# EAGLE design mubi-bot-3 (EAGLE 7.2.0)
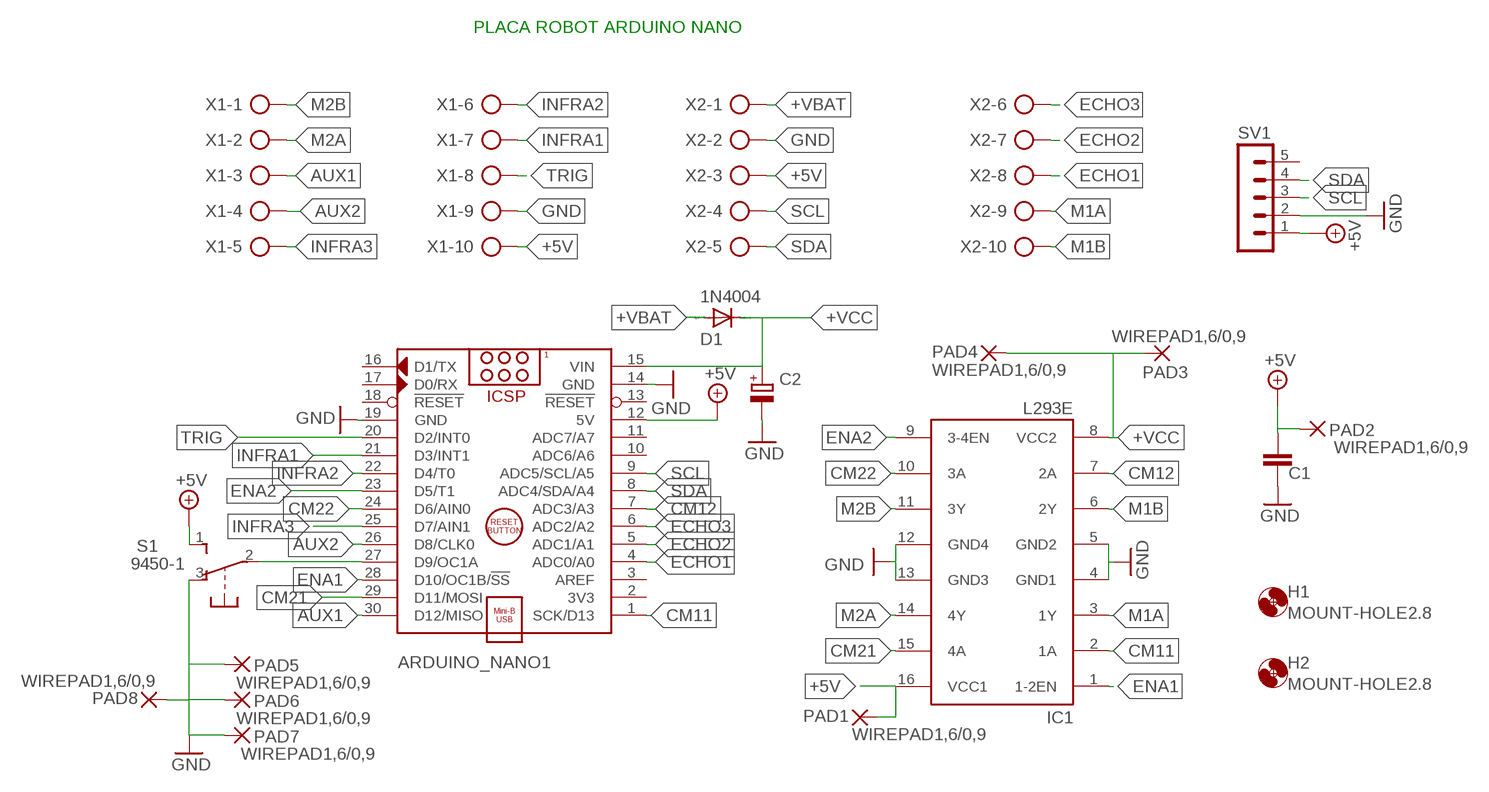
[diagram p0: schematic, sheet 1]

## Parts
ARDUINO_NANO1  ARDUINO_NANO  [ARDUINO_NANO]
C1  C-EU050-025X075  [C050-025X075]
C2  CPOL-EUE2.5-5  [E2,5-5]
D1  1N4004  [DO41-10]
H1  MOUNT-HOLE2.8  [2,8]
H2  MOUNT-HOLE2.8  [2,8]
IC1  L293E  [DIL16]
PAD1  WIREPAD1,6/0,9  [1,6/0,9]
PAD2  WIREPAD1,6/0,9  [1,6/0,9]
PAD3  WIREPAD1,6/0,9  [1,6/0,9]
PAD4  WIREPAD1,6/0,9  [1,6/0,9]
PAD5  WIREPAD1,6/0,9  [1,6/0,9]
PAD6  WIREPAD1,6/0,9  [1,6/0,9]
PAD7  WIREPAD1,6/0,9  [1,6/0,9]
PAD8  WIREPAD1,6/0,9  [1,6/0,9]
S1  9450-1  [9450-1]
SV1  MA05-1  [MA05-1]
X1  AK500/10-H  [AK500/10-H]
X2  AK500/10-H  [AK500/10-H]

## Nets
+5V: ARDUINO_NANO1.12(5V) C1.1 IC1.16(VCC1) PAD1.1(P) PAD2.1(P) S1.1(S) SV1.1 X1.10 X2.3
+VBAT: D1.A X2.1
+VCC: ARDUINO_NANO1.15(VIN) C2.+ D1.C IC1.8(VCC2) PAD3.1(P) PAD4.1(P)
AUX1: ARDUINO_NANO1.30(D12/MISO) X1.3
AUX2: ARDUINO_NANO1.26(D8/CLK0) X1.4
CM11: ARDUINO_NANO1.1(SCK/D13) IC1.2(1A)
CM12: ARDUINO_NANO1.7(ADC3/A3) IC1.7(2A)
CM21: ARDUINO_NANO1.29(D11/MOSI) IC1.15(4A)
CM22: ARDUINO_NANO1.24(D6/AIN0) IC1.10(3A)
ECHO1: ARDUINO_NANO1.4(ADC0/A0) X2.8
ECHO2: ARDUINO_NANO1.5(ADC1/A1) X2.7
ECHO3: ARDUINO_NANO1.6(ADC2/A2) X2.6
ENA1: ARDUINO_NANO1.28(D10/OC1B/!SS) IC1.1(1-2EN)
ENA2: ARDUINO_NANO1.23(D5/T1) IC1.9(3-4EN)
GND: ARDUINO_NANO1.14(GND) ARDUINO_NANO1.19(GND) C1.2 C2.- IC1.12(GND4) IC1.13(GND3) PAD5.1(P) PAD6.1(P) PAD7.1(P) PAD8.1(P) S1.3(O) SV1.2 X1.9 X2.2
INFRA1: ARDUINO_NANO1.21(D3/INT1) X1.7
INFRA2: ARDUINO_NANO1.22(D4/T0) X1.6
INFRA3: ARDUINO_NANO1.25(D7/AIN1) X1.5
M1A: IC1.3(1Y) X2.9
M1B: IC1.6(2Y) X2.10
M2A: IC1.14(4Y) X1.2
M2B: IC1.11(3Y) X1.1
N$1: IC1.4(GND1) IC1.5(GND2) ; supply symbol labelled GND
N$2: ARDUINO_NANO1.27(D9/OC1A) S1.2(P)
SCL: ARDUINO_NANO1.9(ADC5/SCL/A5) SV1.3 X2.4
SDA: ARDUINO_NANO1.8(ADC4/SDA/A4) SV1.4 X2.5
TRIG: ARDUINO_NANO1.20(D2/INT0) X1.8
Unconnected: ARDUINO_NANO1.2(3V3) ARDUINO_NANO1.3(AREF) ARDUINO_NANO1.10(ADC6/A6) ARDUINO_NANO1.11(ADC7/A7) ARDUINO_NANO1.13(!RESET) ARDUINO_NANO1.16(D1/TX) ARDUINO_NANO1.17(D0/RX) ARDUINO_NANO1.18(!RESET) SV1.5

## Notes on the sheet
- PLACA ROBOT ARDUINO NANO

## Library data of the parts
ARDUINO_NANO1 = ArduinoNanoV30:ARDUINO_NANO: Arduino Nano V3.0 Module Overview: The Arduino Nano is a small, complete, and breadboard-friendly board based on the ATmega328 (Arduino Nano 3.x) or ATmega168 (Arduino Nano 2.x). It has more or less the same functionality of the Arduino Duemilanove, but in a different package. It lacks only a DC power jack, and works with a Mini-B USB cable instead of a standard one. The Nano was designed and is being produced by Gravitech <http://www.gravitech.us/arna30wiatp.html>. General specifications: Item Value Microcontroller Atmel ATmega168 or ATmega328 Operating Voltage (logic level) 5 V Input Voltage (recommended) 7-12 V Input Voltage (limits) 6-20 V Digital I/O Pins 14 (of which 6 provide PWM output) Analog Input Pins 8 DC Current per I/O Pin 40 mA Flash Memory 16 KB (ATmega168) or 32 KB (ATmega328) of which 2 KB used by bootloader SRAM 1 KB (ATmega168) or 2 KB (ATmega328) EEPROM 512 bytes (ATmega168) or 1 KB (ATmega328) Clock Speed 16 MHz Dimensions (Inches) 0.73" x 1.70" Dimensions (mm) 18mm x 45mm Overall height About 9 mm (not including pins) Weigth 5 g Power: The Arduino Nano can be powered via the Mini-B USB connection, 6-20V unregulated external power supply (pin 30), or 5V regulated external power supply (pin 27). The power source is automatically selected to the highest voltage source. Memory: The ATmega168 has 16 KB of flash memory for storing code (of which 2 KB is used for the bootloader); the ATmega328 has 32 KB, (also with 2 KB used for the bootloader). The ATmega168 has 1 KB of SRAM and 512 bytes of EEPROM (which can be read and written with the EEPROM library); the ATmega328 has 2 KB of SRAM and 1 KB of EEPROM. Input and Output: Each of the 14 digital pins on the Nano can be used as an input or output, using pinMode(), digitalWrite(), and digitalRead() functions. They operate at 5 volts. Each pin can provide or receive a maximum of 40 mA and has an internal pull-up resistor (disconnected by default) of 20-50 kOhms. In addition, some pins have specialized functions. Visit Arduino - ArduinoBoardNano <https://www.arduino.cc/en/Main/ArduinoBoardNano>
C1 = resistor:C-EU: CAPACITOR, European symbol
C2 = resistor:CPOL-EU: POLARIZED CAPACITOR, European symbol
D1 = diode:1N4004: DIODE general purpose rectifier, 1 A
H1 H2 = holes:MOUNT-HOLE: MOUNTING HOLE with drill center marker
IC1 = texas:L293E: TI DEVICE; MF: Arrow Electronics; MPN: L293E; OC_FARNELL: 1467711; OC_NEWARK: 89K0732
PAD1-PAD8 = wirepad:WIREPAD: Wire PAD connect wire on PCB
S1 = switch-misc:9450-1: MARQUARDT SWITCH
SV1 = con-lstb:MA05-1: PIN HEADER; OC_FARNELL: unknown; OC_NEWARK: unknown
X1 X2 = con-ptr500:AK500/10-H: CONNECTOR Aug. 2004 / PTR Meßtechnik: Die Bezeichnung der Serie AK505 wurde geändert. Es handelt sich hierbei um AK500 in horizontaler Ausführung.; OC_FARNELL: unknown; OC_NEWARK: unknown

## Net classes
0 default: clearance 0.205 mm

## Board
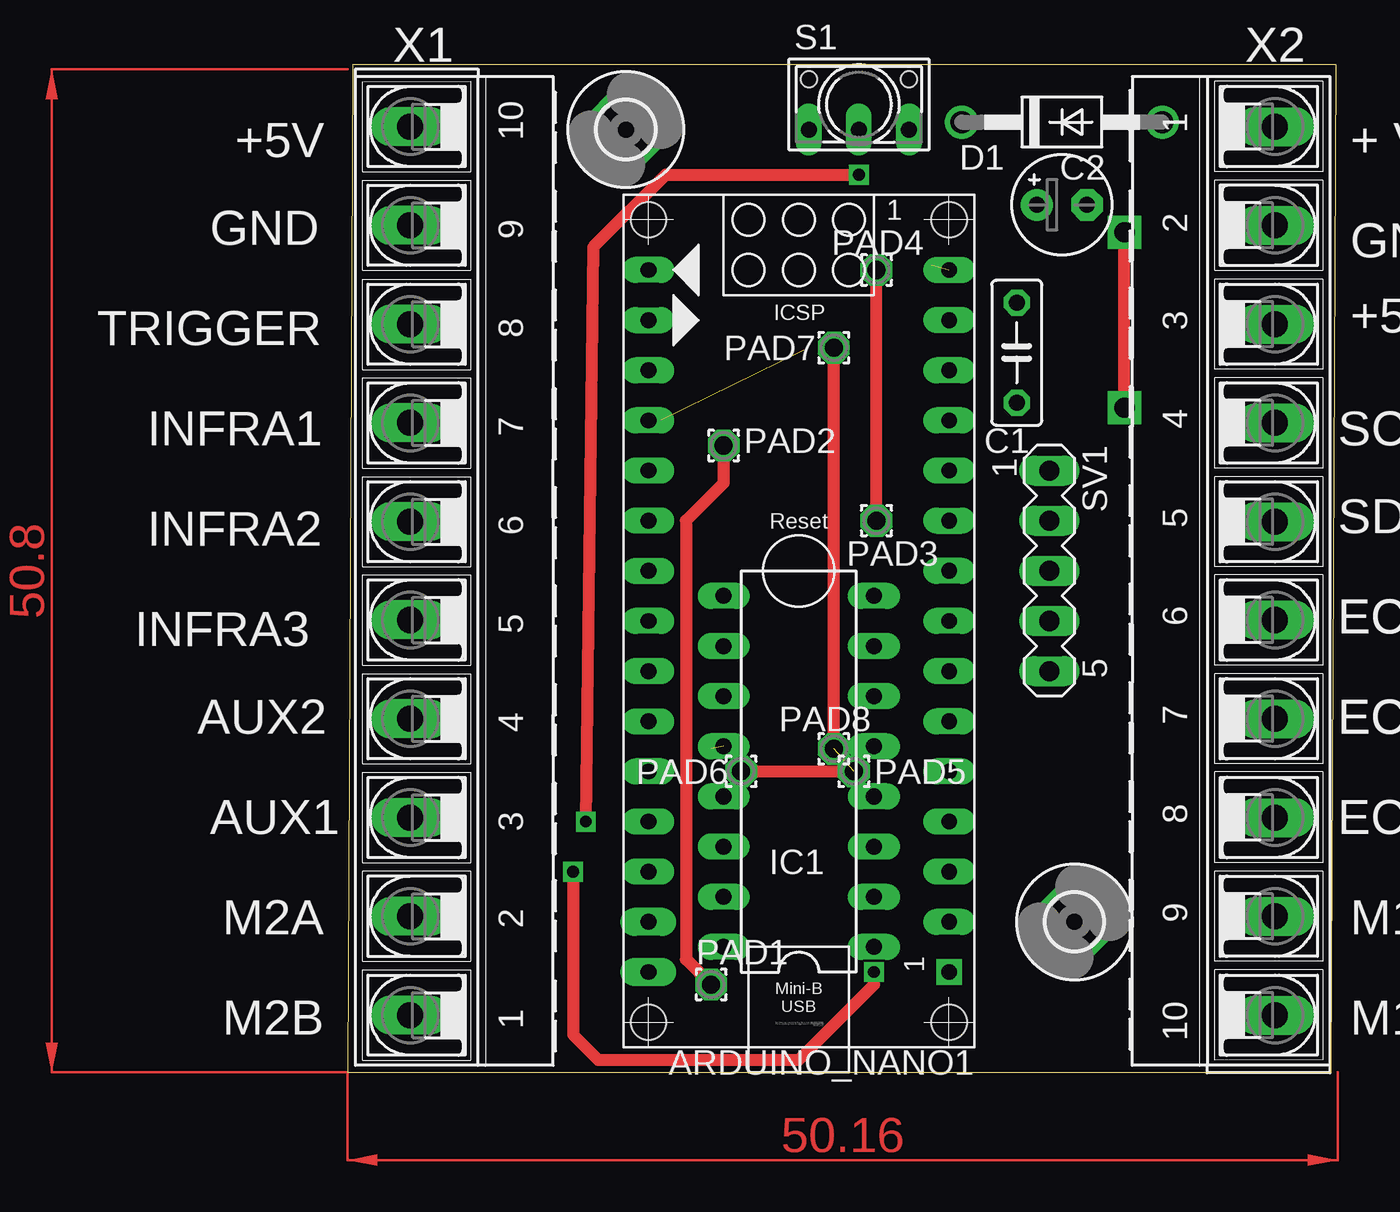
[diagram p1: board, top side]
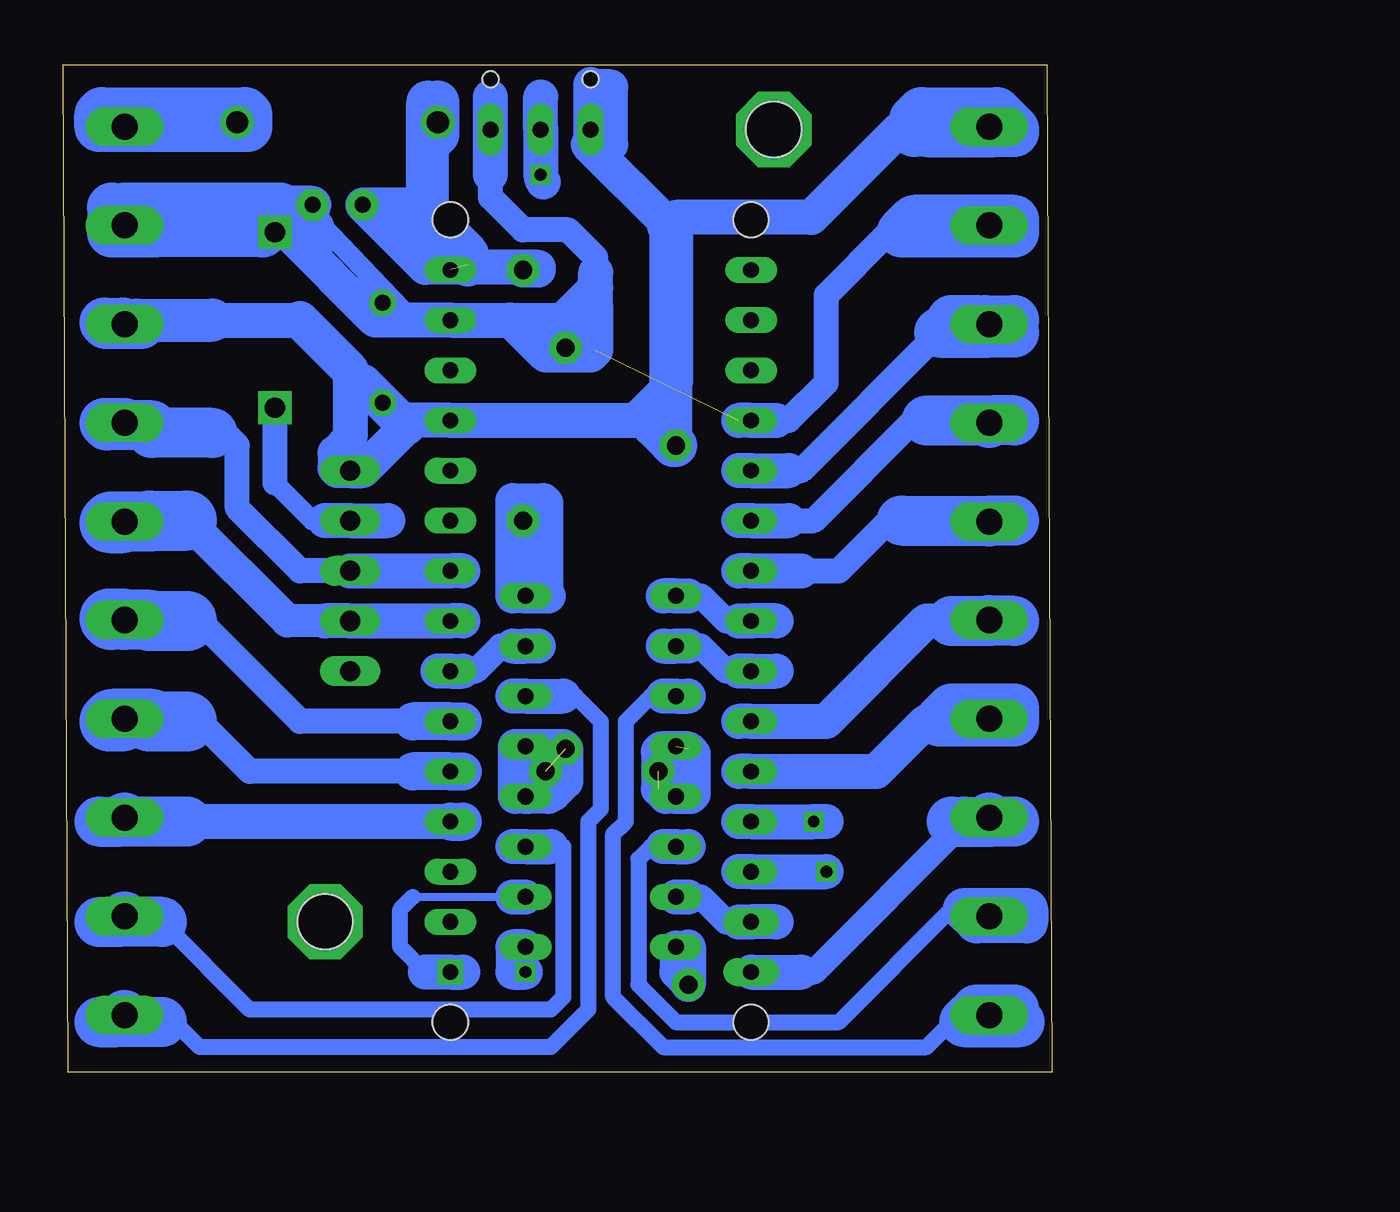
[diagram p2: board, bottom side, seen from below]

Size 50.09 x 51.04 mm. Coordinates in mm from the lower left corner, seen from the top.
Outline: 0,0 49.84,0 50.09,51.04 0.25,51.04 0,0
Copper layers (1*16): Top 0.035mm / dielectric 1.5mm / Bottom 0.035mm
Design rules "default": minimum track width 10mil, minimum drill 24mil, track to track 8mil, track to pad 8mil, pad to pad 8mil, via to via 8mil, smd to smd 8mil, copper to edge 40mil, drill to drill 8mil, minimum pad ring 10mil, minimum via ring 8mil, stop-mask expansion 4mil, vias tented up to drill 0mil, thermal gap 10mil

### Footprints (pad centres in the part's own frame; a part is rotated, then mirrored left to right if it is on the bottom)
ARDUINO_NANO = drill 0.8 pad 1.27 square: 1 -20.32,-7.62 | drill 0.8 long: 2 -17.78,-7.62; 3 -15.24,-7.62; 4 -12.7,-7.62; 5 -10.16,-7.62; 6 -7.62,-7.62; 7 -5.08,-7.62; 8 -2.54,-7.62; 9 0,-7.62; 10 2.54,-7.62; 11 5.08,-7.62; 12 7.62,-7.62; 13 10.16,-7.62; 14 12.7,-7.62; 15 15.24,-7.62; 16 15.24,7.62; 17 12.7,7.62; 18 10.16,7.62; 19 7.62,7.62; 20 5.08,7.62; 21 2.54,7.62; 22 0,7.62; 23 -2.54,7.62; 24 -5.08,7.62; 25 -7.62,7.62; 26 -10.16,7.62; 27 -12.7,7.62; 28 -15.24,7.62 | drill 0.8 pad 1.422 long: 29 -17.78,7.62; 30 -20.32,7.62 | hole 1.778: -22.86,-7.62; -22.86,7.62; 17.78,7.62; 17.78,-7.62
C050-025X075 = drill 0.813 octagon: 1 -2.54,0; 2 2.54,0
E2,5-5 = drill 0.813 pad 1.6: + -1.27,0 | drill 0.813 pad 1.6 octagon: - 1.27,0
DO41-10 = drill 1.118: A 5.08,0; C -5.08,0
2,8 = hole 2.8: 0,0
DIL16 = drill 0.813 long: 1 -8.89,-3.81; 2 -6.35,-3.81; 3 -3.81,-3.81; 4 -1.27,-3.81; 5 1.27,-3.81; 6 3.81,-3.81; 7 6.35,-3.81; 8 8.89,-3.81; 9 8.89,3.81; 10 6.35,3.81; 11 3.81,3.81; 12 1.27,3.81; 13 -1.27,3.81; 14 -3.81,3.81; 15 -6.35,3.81; 16 -8.89,3.81
1,6/0,9 = drill 0.914 pad 1.6 octagon: 1 0,0
9450-1 = drill 0.813 long: 1 -2.54,-1.27; 2 0,-1.27; 3 2.54,-1.27 | hole 0.813: 2.54,1.27; -2.54,1.27
MA05-1 = drill 1.016 long: 1 -5.08,0; 2 -2.54,0; 3 0,0; 4 2.54,0; 5 5.08,0
AK500/10-H = drill 1.321 long: 1 -22.504,0; 2 -17.501,0; 3 -12.497,0; 4 -7.493,0; 5 -2.489,0; 6 2.489,0; 7 7.493,0; 8 12.497,0; 9 17.501,0; 10 22.504,0

### Placement (x,y rotation side)
ARDUINO_NANO1  22.86,25.4 90 top
C1  33.91,36.45 90 top
C2  36.2,43.94 0 top
D1  36.2,48.13 0 top
H1  36.83,7.62 0 top
H2  14.1,47.75 0 top
IC1  22.86,15.24 90 top
PAD1  18.41,4.45 0 top
PAD2  19.05,31.75 0 top
PAD3  26.8,27.94 0 top
PAD4  26.8,40.64 0 top
PAD5  25.65,15.24 0 top
PAD6  19.94,15.24 0 top
PAD7  24.64,36.7 0 top
PAD8  24.64,16.38 0 top
S1  25.91,49.02 0 top
SV1  35.56,25.4 270 top
X1  3.17,25.4 90 top
X2  46.99,25.4 270 top

### Tracks (layer width: path | path; a pad name or v marks a point on that pad's centre or on a via)
+5V
  Top 0.61: PAD2.1 19.05,29.84 17.14,27.94 17.14,5.71 PAD1.1
  Bottom 0.813: 6.99,47.62 5.71,47.62
  Bottom 1.676: IC1.16 19.05,5.08 PAD1.1
  Bottom 1.778: 32.38,33.02 32.7,32.7 34.92,30.48 SV1.1 36.2,30.48 36.32,30.61 36.32,31.37 35.56,32.13 35.56,35.56 | 42.55,38.1 38.1,38.1 | 18.41,6.35 PAD1.1 | 33.02,33.02 ARDUINO_NANO1.12 21.08,33.02 19.05,35.05 19.05,42.55 19.43,42.93 | 23.37,50.04 23.37,49.91 | 23.5,46.99 23.37,47.12 S1.1 23.37,49.91 | 23.5,46.99 22.35,46.99 22.35,49.91 23.37,49.91 | 19.43,42.93 23.5,46.99 | 1.91,47.75 7.75,47.75 12.19,43.31 19.05,43.31 19.43,42.93
  Bottom 1.93: 35.56,35.56 38.1,38.1 | 34.92,34.92 C1.1 33.02,33.02 32.7,32.7
  Bottom 2.184: 46.15,37.9 46.35,38.1 42.55,38.1 | PAD2.1 19.18,31.75 19.3,31.88 | 20.19,32.77 19.3,31.88 | 19.3,31.88 19.3,42.8 19.43,42.93
  Bottom 2.54: 6.35,47.62 5.71,47.62 2.9,47.62 | 1.91,47.62 2.9,47.62 | 2.9,47.62 X1.10 | 46.15,37.9 X2.3 | X2.3 47.93,37.9 48.01,37.97 47.07,37.97 X2.3 | 6.99,47.62 6.99,48.26 6.6,48.64 2.79,48.64 1.91,47.75
+VBAT
  Bottom 2.54: X2.1 48.23,47.9 48.26,47.88 48.26,48.51 48.13,48.64 40.89,48.64 40.77,48.51 40.77,47.88 47.88,47.88 48.01,48.01 41.4,48.01 D1.A
+VCC  (1 unrouted)
  Top 0.61: PAD3.1 PAD4.1
  Bottom 1.778: PAD4.1 26.04,40.64 26.04,40.77 31.75,40.77 C2.+ 32.64,43.94 29.59,40.89 | 25.53,24.13 IC1.8 27.3,24.13 27.3,28.96 25.78,28.96 25.65,28.83 25.65,24.51 25.91,24.26 25.91,27.05 PAD3.1
  Bottom 2.184: 29.59,40.89 29.59,41.4 31.62,43.43 31.62,49.15 31.11,49.15 D1.C | D1.C 31.11,47.5 31.24,47.37 31.24,48.01 D1.C
AUX1
  Bottom 1.27: 12.7,5.08 12.06,5.08 4.45,12.7
  Bottom 1.778: ARDUINO_NANO1.30 12.7,5.08
  Bottom 2.54: 5.08,12.7 4.45,12.7 2.97,12.7 | 1.91,12.7 2.97,12.7 | 2.97,12.7 X1.3
AUX2
  Bottom 1.778: 15.88,15.24 ARDUINO_NANO1.26 8.89,15.24 6.35,17.78 5.71,17.78 5.08,17.78
  Bottom 2.54: 5.08,17.78 1.91,17.78 1.91,18.41 5.08,18.41 5.71,17.78 3.3,17.78 X1.4
CM11
  Bottom 0.406: 32.38,8.89 IC1.2
  Bottom 0.813: 31.75,5.08 33.02,6.35 33.02,8.26 32.38,8.89
  Bottom 1.778: 27.3,8.89 IC1.2 | 29.84,5.08 ARDUINO_NANO1.1 31.75,5.08
CM12
  Bottom 1.27: 29.84,20.32 29.21,20.32 27.94,21.59 27.3,21.59
  Bottom 1.778: 31.11,20.32 ARDUINO_NANO1.7 29.84,20.32 | 27.3,21.59 IC1.7 26.04,21.59
CM21
  Bottom 1.27: 18.41,8.89 17.78,8.89 16.51,7.62 15.88,7.62
  Bottom 1.778: IC1.15 18.41,8.89 | 15.88,7.62 ARDUINO_NANO1.29 13.97,7.62
CM22
  Bottom 1.27: 15.88,20.32 16.51,20.32 17.78,21.59 18.41,21.59
  Bottom 1.778: 13.97,20.32 ARDUINO_NANO1.24 15.88,20.32 | 18.41,21.59 IC1.10 19.68,21.59
ECHO1
  Bottom 1.778: ARDUINO_NANO1.4 43.81,12.7
  Bottom 1.93: ARDUINO_NANO1.4 29.84,12.7
  Bottom 2.54: 43.81,12.7 47.19,12.7 | 48.26,12.7 47.19,12.7 | 47.19,12.7 X2.8
ECHO2
  Bottom 1.27: 32.38,15.24 40.64,15.24 43.18,17.78 44.45,17.78
  Bottom 1.93: 29.84,15.24 ARDUINO_NANO1.5 32.38,15.24
  Bottom 3.048: 43.81,17.78 44.45,17.78 45.72,17.78 45.59,17.91 X2.7 | X2.7 47.62,17.91 47.75,17.78 47.12,17.78 X2.7
ECHO3
  Bottom 1.27: 32.38,17.78 38.1,17.78 43.18,22.86 44.45,22.86
  Bottom 1.93: 29.84,17.78 ARDUINO_NANO1.6 32.38,17.78
  Bottom 3.048: 43.81,22.86 44.45,22.86 45.72,22.86 45.67,22.91 X2.6 | X2.6 47.68,22.91 47.75,22.99 47.07,22.99 X2.6
ENA1  (via drill 0.6)
  Top 0.61: v11.43,10.16 11.43,1.91 12.7,0.64 22.86,0.64 26.67,4.45 v26.67,5.08
  Bottom 1.778: 15.88,10.16 ARDUINO_NANO1.28 v11.43,10.16 | IC1.1 27.3,6.35 27.3,5.08 v26.67,5.08
ENA2
  Bottom 1.27: 18.41,24.13 17.78,24.13 16.51,22.86 15.88,22.86
  Bottom 1.778: 19.68,24.13 IC1.9 18.41,24.13 | 15.88,22.86 ARDUINO_NANO1.23 13.97,22.86
GND  (via drill 1.02 pad 1.68)  (4 unrouted)
  Top 0.61: v39.37,33.66 v39.37,42.55 | PAD8.1 PAD7.1 | PAD6.1 PAD5.1
  Bottom 1.016: 39.12,43.81 38.73,43.81 37.59,42.67 36.83,41.91 38.1,44.07 | 38.1,44.07 37.47,44.07 | 38.1,44.07 32.38,38.1 33.66,38.1 C1.2 | 36.83,27.94 37.47,27.94 39.37,29.84
  Bottom 1.27: 13.97,33.02 13.34,33.02 11.43,34.92 11.43,39.37 8.26,42.55 7.62,42.55 | 39.37,29.84 v39.37,33.66 | 23.11,40.51 23.11,41.27 24.51,42.67 26.8,42.67 28.45,44.32 28.45,45.47
  Bottom 1.778: 33.66,27.94 SV1.2 36.83,27.94 | 40.01,42.55 v39.37,42.55 38.73,42.55 34.29,38.1 32.38,38.1 ARDUINO_NANO1.14 27.43,38.1 | 15.88,33.02 ARDUINO_NANO1.19 13.97,33.02 | 28.45,49.4 S1.3 28.45,45.47 | 24.77,38.1 23.75,38.1 | 23.75,38.1 23.11,38.73 | 23.11,38.73 23.11,39.75 | 23.11,39.75 23.11,40.51 | IC1.13 18.29,13.97 18.16,14.1 18.16,16.13 18.41,16.38 19.81,16.38 19.94,16.26 19.94,14.35 19.56,13.97 | 23.75,38.1 23.24,38.1 23.11,37.97 23.11,36.58 23.37,36.32 25.65,36.32 27.43,38.1 | 27.43,38.1 24.77,38.1 | 24.77,38.1 23.11,39.75 | 23.11,38.73 23.11,38.23 PAD7.1
  Bottom 1.93: C1.2 34.92,39.37 | C2.- 39.12,43.94 39.24,43.81
  Bottom 2.54: 40.01,42.55 45.44,42.55 | 45.44,42.55 X2.2 | 3.53,42.55 1.91,42.55 1.91,43.18 6.99,43.18 7.62,42.55 3.53,42.55 | 3.53,42.55 X1.9 | 46.99,43.81 39.24,43.81 39.12,43.81 37.59,42.67 | 46.35,42.55 47.62,42.55 47.62,43.81 46.99,43.18 45.72,43.18 46.35,42.55 | 46.35,42.55 45.44,42.55
INFRA1
  Bottom 1.27: 13.34,27.94 12.06,27.94 6.99,33.02 6.35,33.02
  Bottom 1.778: 15.88,27.94 ARDUINO_NANO1.21 13.34,27.94
  Bottom 2.54: 6.35,33.02 3.05,33.02 | 1.91,33.02 3.05,33.02 | 3.05,33.02 X1.7
INFRA2
  Bottom 1.27: 12.7,25.4 10.79,25.4 8.26,27.94 7.62,27.94
  Bottom 1.778: 15.88,25.4 ARDUINO_NANO1.22 12.7,25.4
  Bottom 2.54: 7.62,27.94 3.12,27.94 | 1.91,27.94 3.12,27.94 | 3.12,27.94 X1.6
INFRA3
  Bottom 1.778: 15.88,17.78 ARDUINO_NANO1.25 11.43,17.78 6.35,22.86 5.08,22.86
  Bottom 2.54: 5.08,22.86 3.12,22.86 | 1.91,22.86 3.12,22.86 | 3.12,22.86 X1.5
M1A
  Bottom 0.813: 25.4,11.43 24.77,11.43 24.77,3.81 25.4,3.17 40.64,3.17 45.09,7.62
  Bottom 1.778: 27.3,11.43 IC1.3 25.4,11.43
  Bottom 2.54: 45.09,7.62 47.27,7.62 | 48.26,7.62 47.27,7.62 | 47.27,7.62 X2.9
M1B
  Bottom 0.813: 24.77,19.05 24.13,19.05 22.86,17.78 22.86,13.34 23.5,12.7 23.5,3.17 25.4,1.27 43.18,1.27 44.45,2.54 45.09,2.54
  Bottom 1.778: 27.3,19.05 IC1.6 24.77,19.05
  Bottom 2.54: 45.09,2.54 47.35,2.54 | 48.26,2.54 47.35,2.54 | 47.35,2.54 X2.10
M2A
  Bottom 0.813: 19.68,11.43 20.32,11.43 20.95,10.79 20.95,4.45 19.05,2.54 10.79,2.54 5.08,8.26 4.45,8.26 3.81,8.26
  Bottom 1.778: 18.41,11.43 IC1.14 19.68,11.43
  Bottom 2.184: 3.81,8.26 1.27,8.26 1.27,7.62 3.81,7.62 4.45,8.26 1.63,8.26 X1.2
M2B
  Bottom 0.813: 19.68,19.05 20.32,19.05 21.59,17.78 21.59,12.7 22.23,12.06 22.23,3.81 19.68,1.27 6.35,1.27 5.08,2.54 4.45,2.54
  Bottom 1.778: 18.41,19.05 IC1.11 19.68,19.05
  Bottom 2.54: 1.91,2.54 1.91,3.17 3.81,3.17 4.45,2.54 1.91,2.54 | 1.91,2.54 1.63,2.54 X1.1
N$1
  Bottom 1.778: IC1.4 27.18,13.97 27.18,16.51 IC1.5 | IC1.5 24.77,16.51 24.64,16.38 24.64,14.73 25.27,14.1 25.4,14.1 25.53,13.97 26.54,13.97 26.54,16.38 IC1.5
N$2  (via drill 0.6)
  Top 0.61: v12.06,12.7 12.45,41.78 16.13,45.47 v25.91,45.47
  Bottom 1.778: 15.88,12.7 ARDUINO_NANO1.27 v12.06,12.7 11.43,12.7 | 25.91,49.4 S1.2 v25.91,45.47 25.78,45.09
N$3  (via drill 2 pad 3.81)
  other vias: 14.1,47.75
N$4  (via drill 2 pad 3.81)
  other vias: 36.83,7.62
SCL
  Bottom 1.27: SV1.3 38.1,25.4 41.27,28.57 41.27,31.75 41.91,32.38 42.55,32.38
  Bottom 1.778: SV1.3 ARDUINO_NANO1.9 29.84,25.4
  Bottom 2.54: 42.55,32.38 45.59,32.38 45.59,32.77 47.88,32.77 48.01,32.89 X2.4
SDA
  Bottom 1.676: 36.83,22.86 38.73,22.86 43.81,27.94
  Bottom 1.778: 36.83,22.86 SV1.4 ARDUINO_NANO1.8 29.84,22.86
  Bottom 3.048: 43.81,27.94 45.72,27.94 45.67,27.89 X2.5 | X2.5 47.68,27.89 47.75,27.81 47.07,27.81 X2.5
TRIG
  Bottom 1.27: 13.34,30.48 12.7,30.48 5.71,37.47
  Bottom 1.778: 15.88,30.48 ARDUINO_NANO1.20 13.34,30.48
  Bottom 2.54: 5.71,37.47 3.17,37.47 | 1.91,37.47 3.17,37.47 | 3.17,37.47 3.81,38.1 | 3.38,38.1 1.91,38.1 | 3.81,38.1 5.08,38.1 | 3.81,38.1 3.38,38.1 | 3.38,38.1 X1.8
(copper drawn outside any net)
  shapes: Top area x2

### Text on the board
tNames: +5V | + VBAT | GND | GND | TRIGGER | +5V | INFRA1 | SCL | INFRA2 | SDA | INFRA3 | ECHO3 | ECHO3 | AUX2 | ECHO2 | ECHO2 | AUX1 | ECHO1 | M2A | M1A | M2B | M1B